# EAGLE design motherboard (EAGLE 7.2.0)
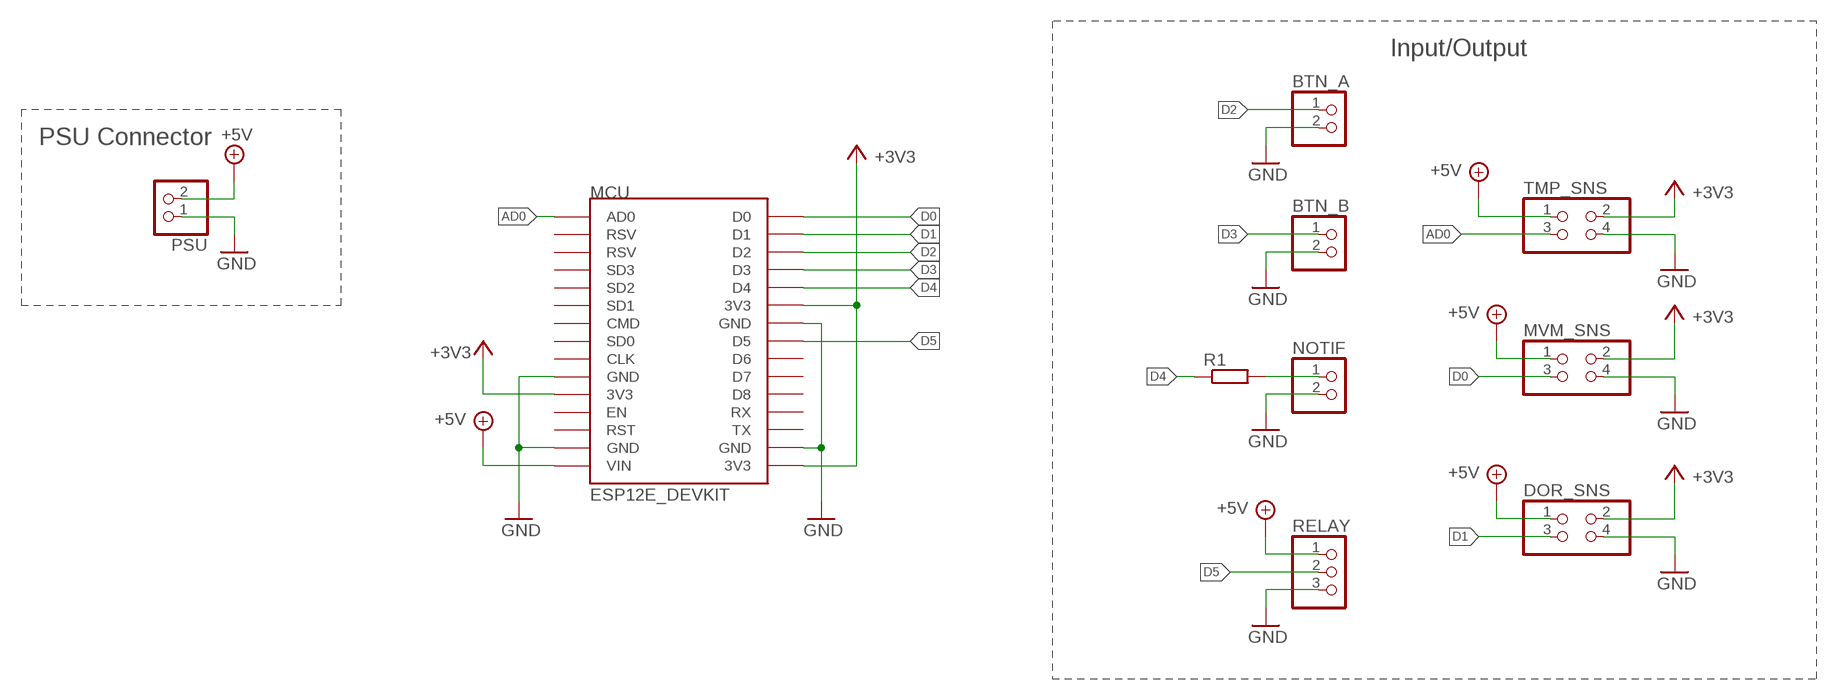
[diagram p0: schematic, sheet 1]

## Parts
BTN_A  PINHD-1X2  [1X02]
BTN_B  PINHD-1X2  [1X02]
DOR_SNS  PINHD-2X2  [2X02]
MCU  ESP12E_DEVKIT  [ESP12E_DEVKIT]
MVM_SNS  PINHD-2X2  [2X02]
NOTIF  PINHD-1X2  [1X02]
PSU  PINHD-1X2  [1X02]
R1  R-EU_0204/7  [0204/7]
RELAY  PINHD-1X3  [1X03]
TMP_SNS  PINHD-2X2  [2X02]

## Nets
+3V3: DOR_SNS.2 MCU.3V3@0(3V3) MCU.3V3@1(3V3) MCU.3V3@2(3V3) MVM_SNS.2 TMP_SNS.2
+5V: DOR_SNS.1 MCU.VIN MVM_SNS.1 PSU.2 RELAY.1 TMP_SNS.1
AD0: MCU.AD0 TMP_SNS.3
D0: MCU.D0 MVM_SNS.3
D1: DOR_SNS.3 MCU.D1
D2: BTN_A.1 MCU.D2
D3: BTN_B.1 MCU.D3
D4: MCU.D4 R1.1
D5: MCU.D5 RELAY.2
GND: BTN_A.2 BTN_B.2 DOR_SNS.4 MCU.GND@0(GND) MCU.GND@1(GND) MCU.GND@2(GND) MCU.GND@3(GND) MVM_SNS.4 NOTIF.2 PSU.1 RELAY.3 TMP_SNS.4
N$1: NOTIF.1 R1.2
Unconnected: MCU.CLK MCU.CMD MCU.D6 MCU.D7 MCU.D8 MCU.EN MCU.RST MCU.RSV@0(RSV) MCU.RSV@1(RSV) MCU.RX MCU.SD0 MCU.SD1 MCU.SD2 MCU.SD3 MCU.TX

## Notes on the sheet
- Input/Output
- PSU Connector

## Library data of the parts
BTN_A BTN_B NOTIF PSU = pinhead:PINHD-1X2: PIN HEADER
DOR_SNS MVM_SNS TMP_SNS = pinhead:PINHD-2X2: PIN HEADER
MCU = ESP12E_DEVKIT:ESP12E_DEVKIT: ESP12E DEVKIT BOARD
R1 = rcl:R-EU_: RESISTOR, European symbol
RELAY = pinhead:PINHD-1X3: PIN HEADER

## Board
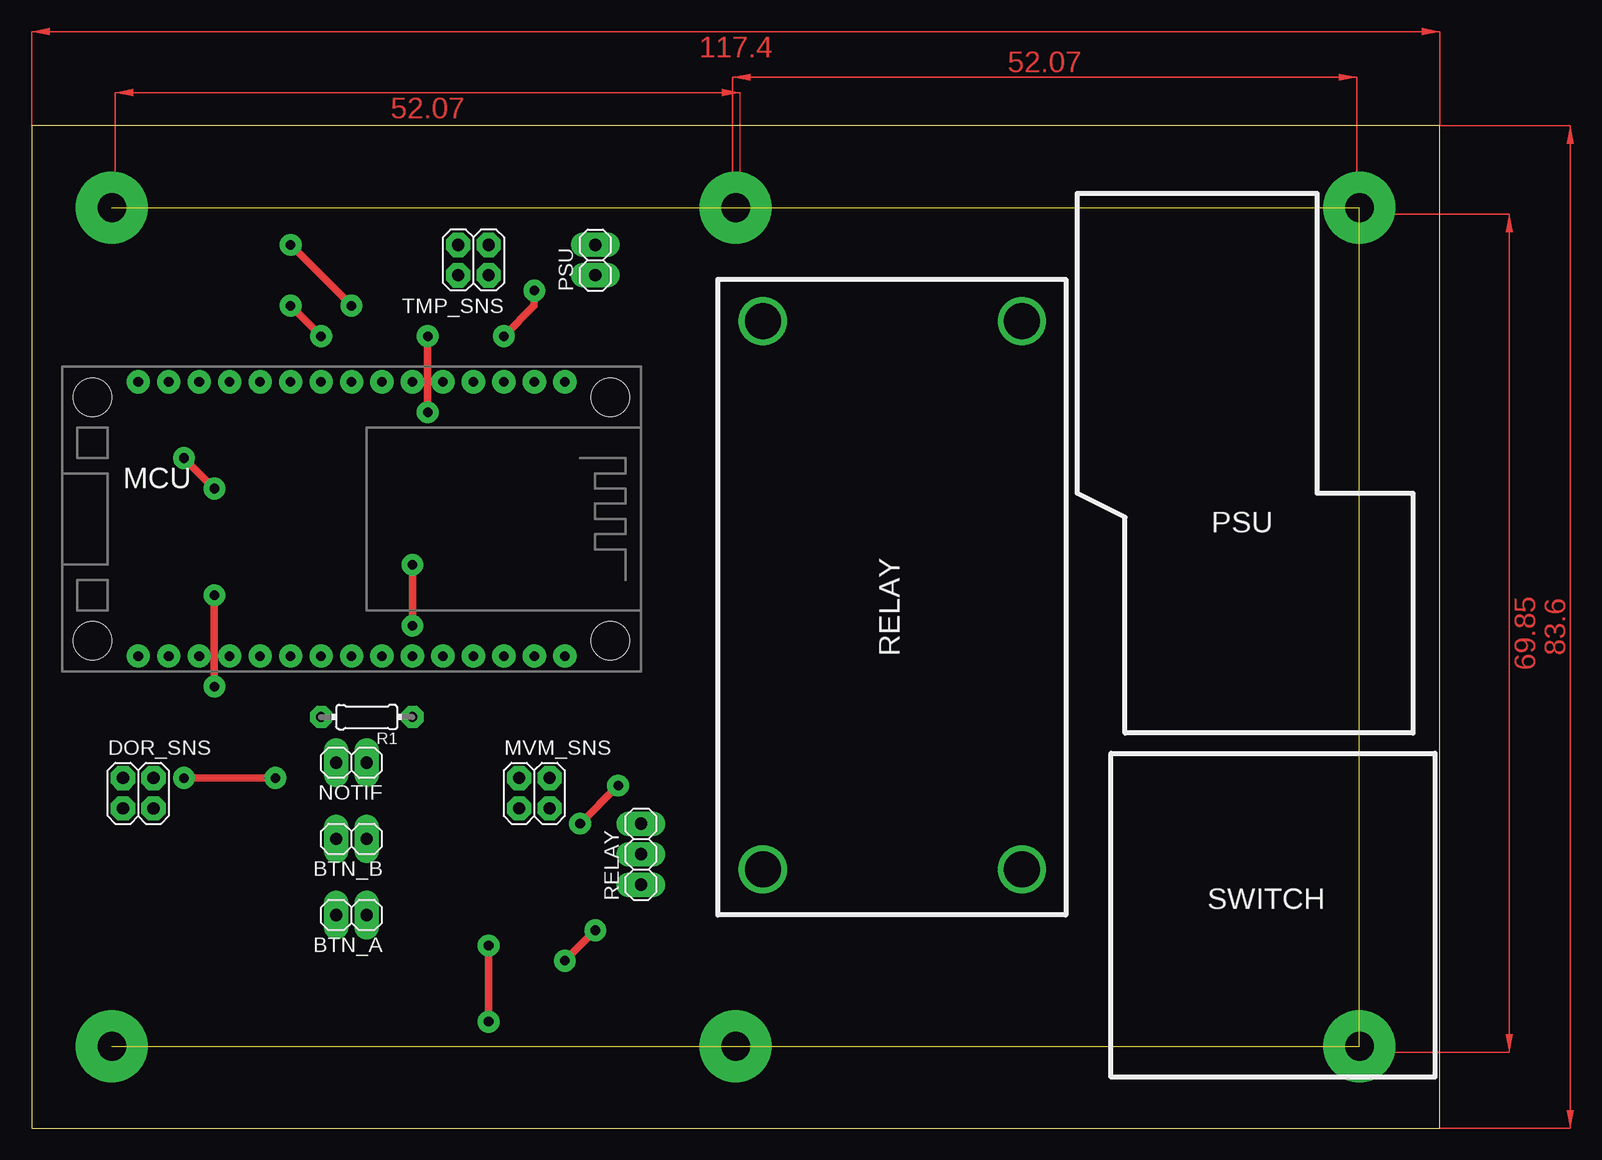
[diagram p1: board, top side]
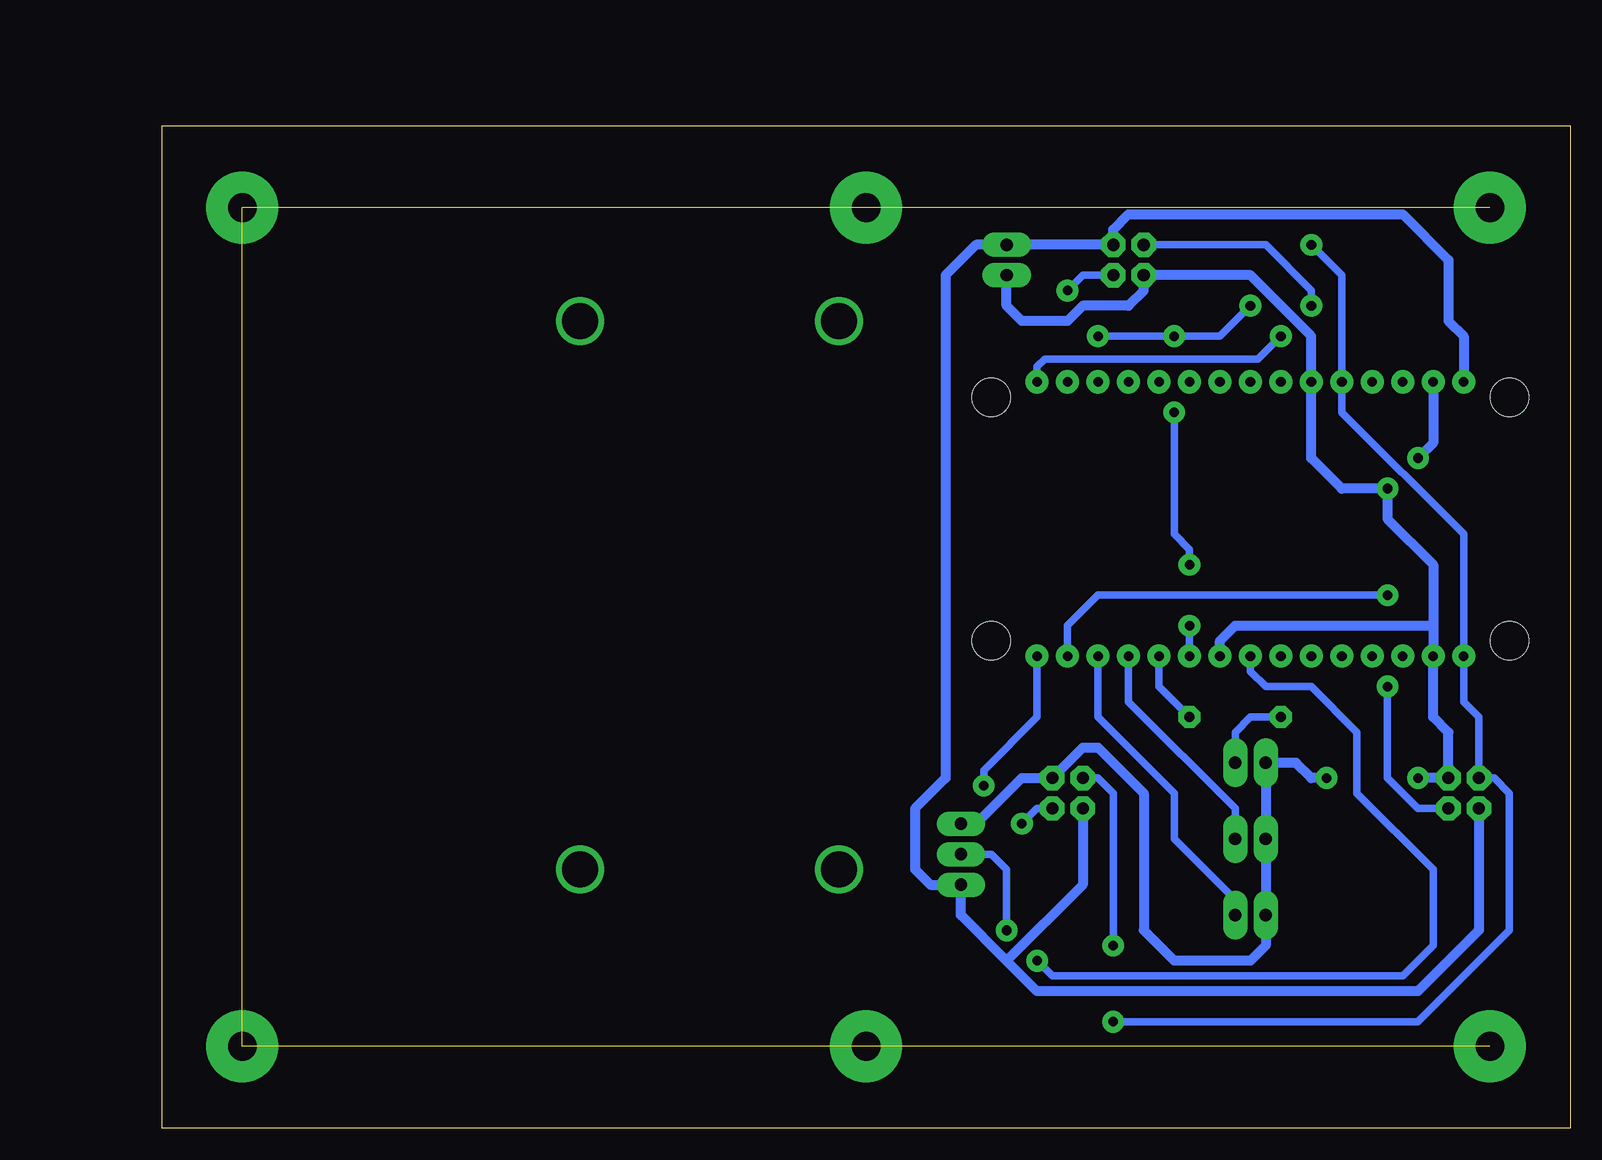
[diagram p2: board, bottom side, seen from below]

Size 117.4 x 83.6 mm. Coordinates in mm from the lower left corner, seen from the top.
Outline: 0,0 117.4,0 117.4,83.6 0,83.6 0,0
Copper layers (1*16): Top 0.035mm / dielectric 1.5mm / Bottom 0.035mm
Design rules "default *": minimum track width 10mil, minimum drill 24mil, track to track 8mil, track to pad 8mil, pad to pad 8mil, via to via 8mil, smd to smd 8mil, copper to edge 40mil, drill to drill 8mil, minimum pad ring 20mil, minimum via ring 20mil, stop-mask expansion 4mil, vias tented up to drill 0mil, thermal gap 10mil

### Footprints (pad centres in the part's own frame; a part is rotated, then mirrored left to right if it is on the bottom)
1X02 = drill 1.016 long: 1 -1.27,0; 2 1.27,0
2X02 = drill 1.016 octagon: 1 -1.27,-1.27; 2 -1.27,1.27; 3 1.27,-1.27; 4 1.27,1.27
ESP12E_DEVKIT = drill 0.8 pad 1.93: 3V3@0 -11.43,-7.62; 3V3@1 11.43,5.08; 3V3@2 11.43,-17.78; AD0 -11.43,17.78; CLK -11.43,-2.54; CMD -11.43,2.54; D0 11.43,17.78; D1 11.43,15.24; D2 11.43,12.7; D3 11.43,10.16; D4 11.43,7.62; D5 11.43,0; D6 11.43,-2.54; D7 11.43,-5.08; D8 11.43,-7.62; EN -11.43,-10.16; GND@0 -11.43,-5.08; GND@1 -11.43,-15.24; GND@2 11.43,2.54; GND@3 11.43,-15.24; RST -11.43,-12.7; RSV@0 -11.43,15.24; RSV@1 -11.43,12.7; RX 11.43,-10.16; SD0 -11.43,0; SD1 -11.43,5.08; SD2 -11.43,7.62; SD3 -11.43,10.16; TX 11.43,-12.7; VIN -11.43,-17.78 | hole 3.2: -10.16,21.59; 10.16,21.59; 10.16,-21.59; -10.16,-21.59
0204/7 = drill 0.813 octagon: 1 -3.81,0; 2 3.81,0
1X03 = drill 1.016 long: 1 -2.54,0; 2 0,0; 3 2.54,0

### Placement (x,y rotation side)
BTN_A  26.67,17.78 180 top
BTN_B  26.67,24.13 180 top
DOR_SNS  8.89,27.94 0 top
MCU  26.67,50.8 270 top
MVM_SNS  41.91,27.94 0 top
NOTIF  26.67,30.48 180 top
PSU  46.99,72.39 90 top
R1  100R  [0204/7]  27.94,34.29 180 top
RELAY  50.8,22.86 90 top
TMP_SNS  36.83,72.39 180 top

### Tracks (layer width: path | path; a pad name or v marks a point on that pad's centre or on a via)
+3V3  (via drill 0.8)
  Top 0.61: v41.91,69.85 41.91,68.58 v39.37,66.04 | v26.67,68.58 v21.59,73.66 | v38.1,15.24 v38.1,8.89 | v31.75,41.91 v31.75,46.99 | v33.02,66.04 v33.02,59.69
  Bottom 0.61: TMP_SNS.2 40.64,71.12 v41.91,69.85 | v26.67,68.58 29.21,66.04 v33.02,66.04 v39.37,66.04 | v21.59,73.66 19.05,71.12 MCU.3V3@0 19.05,59.69 8.89,49.53 MCU.3V3@2 8.89,35.56 7.62,34.29 DOR_SNS.2 6.35,29.21 5.08,27.94 5.08,16.51 12.7,8.89 v38.1,8.89 | MVM_SNS.2 39.37,29.21 38.1,27.94 v38.1,15.24 | MCU.3V3@1 v31.75,41.91 | v33.02,59.69 33.02,49.53 31.75,48.26 v31.75,46.99
+5V
  Bottom 0.61: 40.64,22.86 MVM_SNS.1 | RELAY.1 52.07,20.32
  Bottom 0.813: MCU.VIN 8.89,66.04 10.16,67.31 10.16,72.39 13.97,76.2 36.83,76.2 38.1,74.93 TMP_SNS.1 PSU.2 49.53,73.66 52.07,71.12 52.07,29.21 54.61,26.67 54.61,21.59 53.34,20.32 RELAY.1 50.8,17.78 46.99,13.97 | DOR_SNS.1 7.62,16.51 12.7,11.43 44.45,11.43 46.99,13.97 | MVM_SNS.1 40.64,20.32 46.99,13.97
AD0  (via drill 0.8)
  Top 0.61: v24.13,66.04 v21.59,68.58
  Bottom 0.61: v21.59,68.58 21.59,69.85 25.4,73.66 TMP_SNS.3 | v24.13,66.04 26.04,64.14 43.81,64.14 44.45,63.5 MCU.AD0
D0  (via drill 0.8)
  Top 0.61: v45.72,25.4 v48.9,28.57
  Bottom 0.61: MVM_SNS.3 44.45,26.67 v45.72,25.4 | v48.9,28.57 48.9,29.84 44.45,34.29 MCU.D0
D1  (via drill 0.8)
  Top 0.61: v15.24,36.83 v15.24,44.45
  Bottom 0.61: DOR_SNS.3 12.7,26.67 15.24,29.21 v15.24,36.83 | v15.24,44.45 39.37,44.45 41.91,41.91 MCU.D1
D2
  Bottom 0.61: BTN_A.1 27.94,19.05 33.02,24.13 33.02,27.94 39.37,34.29 MCU.D2
D3
  Bottom 0.61: BTN_B.1 27.94,26.67 36.83,35.56 MCU.D3
D4
  Bottom 0.61: R1.1 34.29,36.83 MCU.D4
D5  (via drill 0.8)
  Top 0.61: v44.45,13.97 v46.99,16.51
  Bottom 0.61: MCU.D5 26.67,38.1 25.4,36.83 21.59,36.83 17.78,33.02 17.78,27.94 11.43,21.59 11.43,15.24 13.97,12.7 43.18,12.7 v44.45,13.97 | v46.99,16.51 46.99,21.59 48.26,22.86 RELAY.2
GND  (via drill 0.8)
  Top 0.61: v12.7,55.88 v15.24,53.34 | v12.7,29.21 v20.32,29.21
  Bottom 0.61: RELAY.3 49.53,25.4
  Bottom 0.813: MCU.GND@1 11.43,57.15 v12.7,55.88 | 11.43,41.91 11.43,46.99 15.24,50.8 v15.24,53.34 19.05,53.34 21.59,55.88 MCU.GND@0 21.59,66.04 26.67,71.12 TMP_SNS.4 35.56,69.85 36.83,68.58 40.64,68.58 41.91,67.31 45.72,67.31 46.99,68.58 PSU.1 | 11.43,41.91 MCU.GND@3 11.43,34.29 10.16,33.02 DOR_SNS.4 v12.7,29.21 | v20.32,29.21 21.59,29.21 22.86,30.48 NOTIF.2 BTN_B.2 BTN_A.2 25.4,15.24 26.67,13.97 33.02,13.97 35.56,16.51 35.56,27.94 39.37,31.75 40.64,31.75 MVM_SNS.4 45.72,29.21 49.53,25.4 | MCU.GND@2 29.21,40.64 27.94,41.91 11.43,41.91
N$1
  Bottom 0.61: NOTIF.1 27.94,33.02 26.67,34.29 R1.2
N$2  (via drill 2.4 pad 6)  (5 unrouted)
  other vias: 6.7,76.75 110.7,6.85 6.7,6.85 110.7,76.75 58.7,76.75 58.7,6.85
N$3  (via drill 3)
  other vias: 60.96,67.31
N$4  (via drill 3)
  other vias: 82.55,67.31
N$5  (via drill 3)
  other vias: 82.55,21.59
N$6  (via drill 3)
  other vias: 60.96,21.59
(copper drawn outside any net)
  shapes: Top area x5

### Text on the board
tPlace: PSU | RELAY | SWITCH